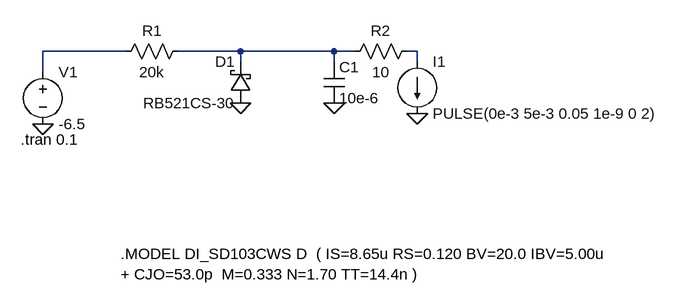
[diagram p0: schematic schottky_dioge_neg_voltage.asc]
schottky_dioge_neg_voltage.asc, the LTspice schematic file:
Version 4
SHEET 1 1204 680
WIRE 160 64 32 64
WIRE 336 64 240 64
WIRE 480 64 336 64
WIRE 512 64 480 64
WIRE 608 64 592 64
WIRE 336 80 336 64
WIRE 480 80 480 64
WIRE 608 80 608 64
WIRE 32 96 32 64
FLAG 32 176 0
FLAG 336 144 0
FLAG 480 144 0
FLAG 608 160 0
SYMBOL voltage 32 80 R0
WINDOW 123 0 0 Left 0
WINDOW 39 0 0 Left 0
SYMATTR InstName V1
SYMATTR Value -6.5
SYMBOL res 256 48 R90
WINDOW 0 0 56 VBottom 2
WINDOW 3 32 56 VTop 2
SYMATTR InstName R1
SYMATTR Value 20k
SYMBOL schottky 352 144 R180
WINDOW 0 24 64 Left 2
WINDOW 3 24 0 Left 2
SYMATTR InstName D1
SYMATTR Value RB521CS-30
SYMATTR Description Diode
SYMATTR Type diode
SYMBOL cap 464 80 R0
SYMATTR InstName C1
SYMATTR Value 10e-6
SYMBOL current 608 80 R0
WINDOW 123 0 0 Left 0
WINDOW 39 0 0 Left 0
SYMATTR InstName I1
SYMATTR Value PULSE(0e-3 5e-3 0.05 1e-9 0 2)
SYMBOL res 608 48 R90
WINDOW 0 0 56 VBottom 2
WINDOW 3 32 56 VTop 2
SYMATTR InstName R2
SYMATTR Value 10
TEXT -2 200 Left 2 !.tran 0.1
TEXT 152 376 Left 2 !.MODEL DI_SD103CWS D  ( IS=8.65u RS=0.120 BV=20.0 IBV=5.00u \n+ CJO=53.0p  M=0.333 N=1.70 TT=14.4n )

The netlist it stands for:
* schottky_dioge_neg_voltage.asc
V1 N001 0 -6.5
R1 N002 N001 20k
D1 0 N002 RB521CS-30
C1 N002 0 10e-6
I1 N003 0 PULSE(0e-3 5e-3 0.05 1e-9 0 2)
R2 N003 N002 10
.model D D
.lib standard.dio
.tran 0.1
.MODEL DI_SD103CWS D  ( IS=8.65u RS=0.120 BV=20.0 IBV=5.00u
+ CJO=53.0p  M=0.333 N=1.70 TT=14.4n )
.backanno
.end